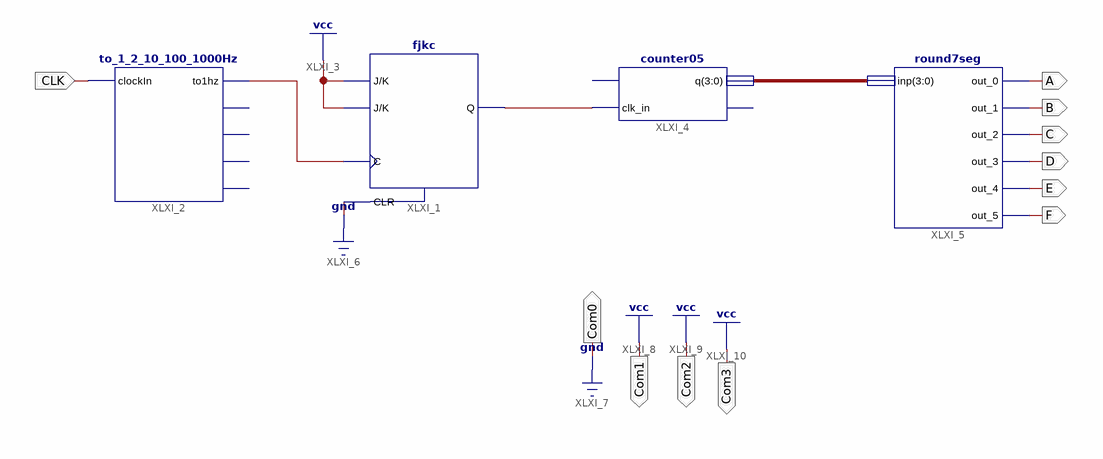
[diagram p0: schematic sheet 1]
// Xilinx ISE schematic main.sch (spartan6) as structural Verilog: 4 symbols, 11 ports
module main (
  input  CLK,
  output A,
  output B,
  output C,
  output D,
  output E,
  output F,
  output Com0,
  output Com1,
  output Com2,
  output Com3
);

  wire XLXN_3, XLXN_6;
  wire [3:0] XLXN_5;

  fjkc XLXI_1 (.C(XLXN_3), .CLR(1'b0), .J(1'b1), .K(1'b1), .Q(XLXN_6));
  to_1_2_10_100_1000Hz XLXI_2 (.clockIn(CLK), .to1hz(XLXN_3));  // open: to2hz, to10hz, to100hz, to1000hz
  counter05 XLXI_4 (.clk_in(XLXN_6), .q(XLXN_5));  // open: clear, divide_6
  round7seg XLXI_5 (.inp(XLXN_5), .out_0(A), .out_1(B), .out_2(C), .out_3(D), .out_4(E), .out_5(F));

  assign Com0 = 1'b0;
  assign Com1 = 1'b1;
  assign Com2 = 1'b1;
  assign Com3 = 1'b1;
endmodule
